# EAGLE design LLAP_Temp (EAGLE 7.1.0)
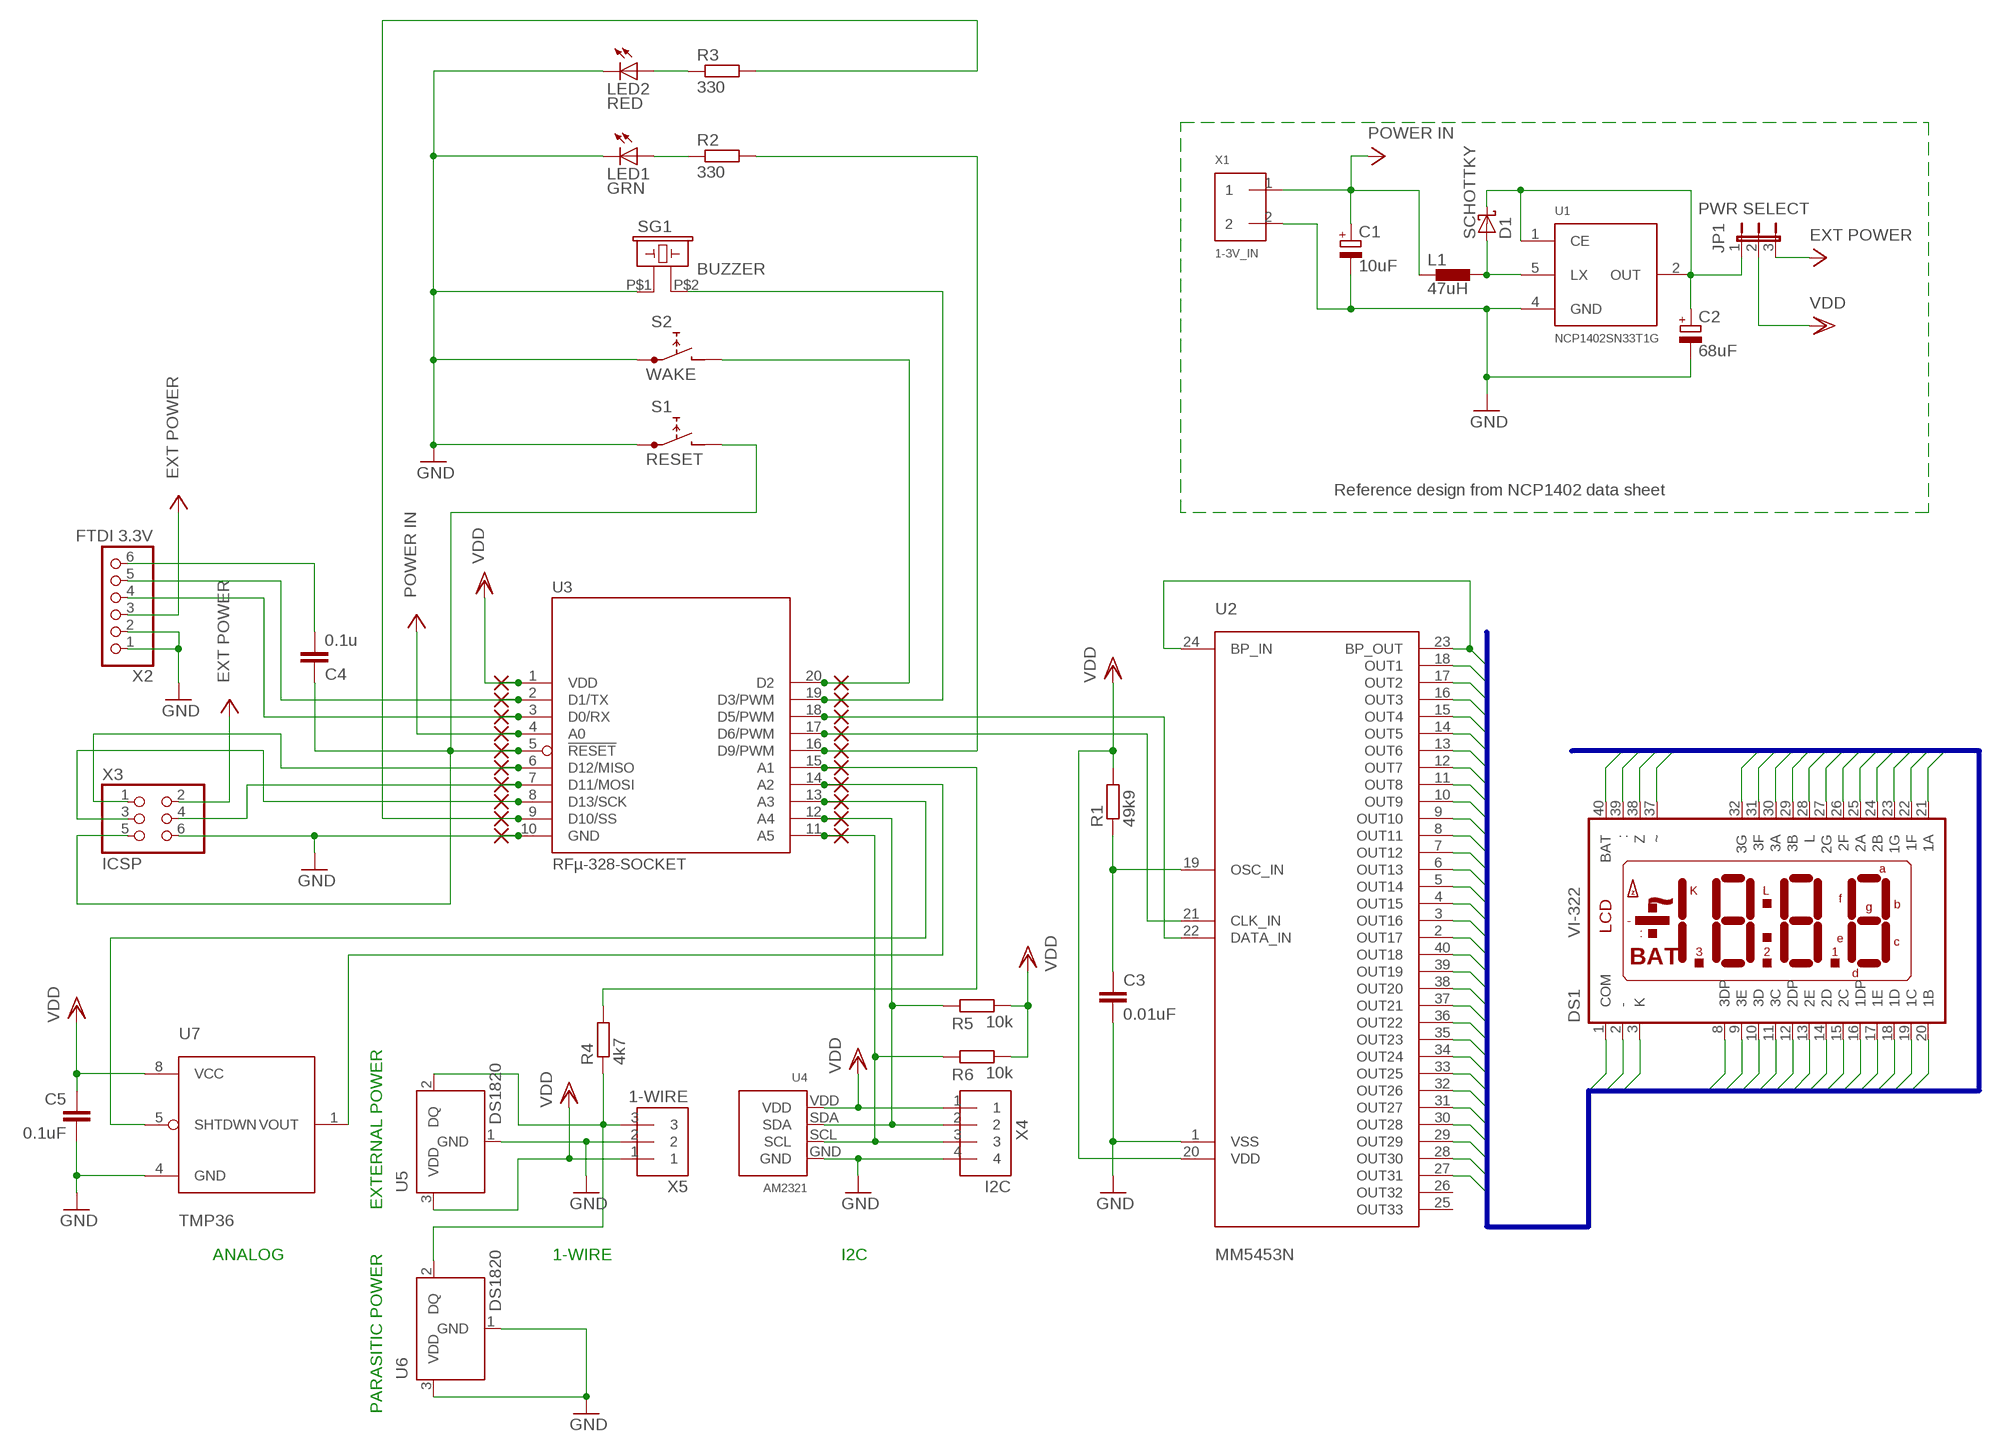
[diagram p0: schematic, sheet 1]

## Parts
C1  10uF  T491EIA6032-25  [EIA6032–25]
C2  68uF  T491EIA7343-31  [EIA7343-31]
C3  0.01uF  C-EUC0805  [C0805]
C4  0.1u  C-EUC0805  [C0805]
C5  0.1uF  C-EUC0805  [C0805]
D1  SCHOTTKY  DIODE_SCHOTTKY  [SOT-123_DIODE]
DS1  VI-322  LCD-VARITRONIX-VI-322  [LCD-VARITRONIX-VI-322]
JP1  PWR SELECT  JP2E  [JP2]
L1  47uH  SRN5040SRN5040SRN5040  [SRN5040]
LED1  GRN  LED3MM  [LED3MM]
LED2  RED  LED3MM  [LED3MM]
PAD1  VDD  1,6/0,9  [PAD_1,6/0,9]
PAD2  TX  1,6/0,9  [PAD_1,6/0,9]
PAD3  RX  1,6/0,9  [PAD_1,6/0,9]
PAD4  BATT V.  1,6/0,9  [PAD_1,6/0,9]
PAD5  RST  1,6/0,9  [PAD_1,6/0,9]
PAD6  MISO  1,6/0,9  [PAD_1,6/0,9]
PAD7  MOSI  1,6/0,9  [PAD_1,6/0,9]
PAD8  SCK  1,6/0,9  [PAD_1,6/0,9]
PAD9  LED2  1,6/0,9  [PAD_1,6/0,9]
PAD10  GND  1,6/0,9  [PAD_1,6/0,9]
PAD11  SCL  1,6/0,9  [PAD_1,6/0,9]
PAD12  SDA  1,6/0,9  [PAD_1,6/0,9]
PAD13  TMP SHTDWN  1,6/0,9  [PAD_1,6/0,9]
PAD14  TMP MEAS.  1,6/0,9  [PAD_1,6/0,9]
PAD15  1-WIRE  1,6/0,9  [PAD_1,6/0,9]
PAD16  LED1  1,6/0,9  [PAD_1,6/0,9]
PAD17  LCD CLK  1,6/0,9  [PAD_1,6/0,9]
PAD18  LCD DATA  1,6/0,9  [PAD_1,6/0,9]
PAD19  BUZZER  1,6/0,9  [PAD_1,6/0,9]
PAD20  WAKE BTN  1,6/0,9  [PAD_1,6/0,9]
R1  49k9  R-EU_R0805  [R0805]
R2  330  R-EU_R0805  [R0805]
R3  330  R-EU_R0805  [R0805]
R4  4k7  R-EU_R0805  [R0805]
R5  10k  R-EU_R0805  [R0805]
R6  10k  R-EU_R0805  [R0805]
S1  RESET  SWITCH-MJTP1243/MJTP1250MJTP1243/MJTP1250  [SWITCH-MJTP12XX]
S2  WAKE  SWITCH-MJTP1243/MJTP1250MJTP1243/MJTP1250  [SWITCH-MJTP12XX]
SG1  BUZZER  BUZZER-PUI_AUDIO-AT-1340-TT-R  [BUZZER-PUI_AUDIO-AT-1340-TT-R]
U1  NCP1402SN33T1G  NCP1402  [SOT23-5L]
U2  MM5453N  MM5453  [DIL40]
U3  RFµ-328-SOCKET  [RFµ-328-SOCKET]
U4  AM2321  AOSONG-AM2321AM2321  [AM2321]
U5  DS1820  [TO-92]
U6  DS1820  [TO-92]
U7  TMP36  TMP35/TMP36/TMP37SOIC8  [SOIC8]
X1  1-3V_IN  CON-AMP-440055-2440055-2  [CON-AMP-440055-2]
X2  FTDI 3.3V  PINHD-1X6  [1X06]
X3  ICSP  PINHD-2X3  [2X03]
X4  I2C  CON-AMP-440055-4440055-4  [CON-AMP-440055-4]
X5  1-WIRE  CON-AMP-440055-3440055-3  [CON-AMP-440055-3]

## Nets
3.3V: C2.P$2(+) D1.C JP1.1 U1.1(CE) U1.2(OUT)
BP: DS1.1(COM) U2.23(BP_OUT) U2.24(BP_IN)
EXT_PWR: JP1.3 X2.3 X3.2 ; supply symbol labelled EXT POWER
GND: C1.P$1(-) C2.P$1(-) C3.2 C5.2 LED1.K(C) LED2.K(C) PAD10.1(P) S1.P$1 S2.P$1 SG1.P$1 U1.4(GND) U2.1(VSS) U3.10(GND) U4.GND U5.1(GND) U6.1(GND) U6.3(VDD) U7.4(GND) X1.2 X2.1 X2.2 X3.6 X4.4 X5.2
LCD1: DS1.21(1A) U2.18(OUT1)
LCD2: DS1.20(1B) U2.17(OUT2)
LCD3: DS1.19(1C) U2.16(OUT3)
LCD4: DS1.18(1D) U2.15(OUT4)
LCD5: DS1.17(1E) U2.14(OUT5)
LCD6: DS1.22(1F) U2.13(OUT6)
LCD7: DS1.23(1G) U2.12(OUT7)
LCD8: DS1.16(1DP) U2.11(OUT8)
LCD9: DS1.25(2A) U2.10(OUT9)
LCD10: DS1.24(2B) U2.9(OUT10)
LCD11: DS1.15(2C) U2.8(OUT11)
LCD12: DS1.14(2D) U2.7(OUT12)
LCD13: DS1.13(2E) U2.6(OUT13)
LCD14: DS1.26(2F) U2.5(OUT14)
LCD15: DS1.27(2G) U2.4(OUT15)
LCD16: DS1.12(2DP) U2.3(OUT16)
LCD17: DS1.28(L) U2.2(OUT17)
LCD18: DS1.30(3A) U2.40(OUT18)
LCD19: DS1.29(3B) U2.39(OUT19)
LCD20: DS1.11(3C) U2.38(OUT20)
LCD21: DS1.10(3D) U2.37(OUT21)
LCD22: DS1.9(3E) U2.36(OUT22)
LCD23: DS1.31(3F) U2.35(OUT23)
LCD24: DS1.32(3G) U2.34(OUT24)
LCD25: DS1.8(3DP) U2.33(OUT25)
LCD26: DS1.3(K) U2.32(OUT26)
LCD27: DS1.2(-) U2.31(OUT27)
LCD28: DS1.39(:) U2.30(OUT28)
LCD29: DS1.40(BAT) U2.29(OUT29)
LCD30: DS1.38(Z) U2.28(OUT30)
LCD31: DS1.37(~) U2.27(OUT31)
N$1: C4.1 PAD5.1(P) S1.P$2 U3.5(!RESET) X3.5
N$2: PAD15.1(P) R4.2 U3.15(A1)
N$3: PAD6.1(P) U3.6(D12/MISO) X3.1
N$4: R4.1 U5.2(DQ) U6.2(DQ) X5.3
N$5: PAD13.1(P) U3.13(A3) U7.5(SHTDWN)
N$6: LED2.A R3.1
N$7: PAD14.1(P) U3.14(A2) U7.1(VOUT)
N$9: PAD2.1(P) U3.2(D1/TX) X2.5
N$10: PAD3.1(P) U3.3(D0/RX) X2.4
N$18: PAD18.1(P) U2.22(DATA_IN) U3.18(D5/PWM)
N$19: PAD17.1(P) U2.21(CLK_IN) U3.17(D6/PWM)
N$37: D1.A L1.2 U1.5(LX)
N$38: C3.1 R1.1 U2.19(OSC_IN)
N$39: LED1.A R2.1
N$40: PAD16.1(P) R2.2 U3.16(D9/PWM)
N$41: C4.2 X2.6
N$42: PAD8.1(P) U3.8(D13/SCK) X3.3
N$48: PAD7.1(P) U3.7(D11/MOSI) X3.4
N$50: PAD9.1(P) R3.2 U3.9(D10/SS)
N$52: PAD20.1(P) S2.P$2 U3.20(D2)
N$53: PAD11.1(P) R6.1 U3.11(A5) U4.SCL X4.3
N$54: PAD12.1(P) R5.1 U3.12(A4) U4.SDA X4.2
N$55: PAD19.1(P) SG1.P$2 U3.19(D3/PWM)
POWER_IN: C1.P$2(+) L1.1 PAD4.1(P) U3.4(A0) X1.1 ; supply symbol labelled POWER IN
VDD: C5.1 JP1.2 PAD1.1(P) R1.2 R5.2 R6.2 U2.20(VDD) U3.1(VDD) U4.VDD U5.3(VDD) U7.8(VCC) X4.1 X5.1
Unconnected: U2.25(OUT33) U2.26(OUT32)

## Buses
LCD[1..33],BP

## Notes on the sheet
- Reference design from NCP1402 data sheet
- EXTERNAL POWER
- ANALOG | 1-WIRE | I2C
- PARASITIC POWER

## Library data of the parts
C1 C2 = Johan:T491: T491 Series Industrial Grade MnO2 Tantalum Surface Mount Capacitor
C3-C5 = rcl:C-EU: CAPACITOR, European symbol
D1 = Johan:DIODE_SCHOTTKY: Schottky Power Rectifier Source: http://www.onsemi.com/pub/Collateral/MBRS130LT3-D.PDF
DS1 = Johan:LCD-VARITRONIX-VI-322: Varitronix LCD display, 3,5 digits 7 segment VI-322
JP1 = Johan:JP2E: JUMPER
L1 = Johan:SRN5040: BOURNS (R) SRN5040 Series - Semi-shielded Power Inductors
LED1 LED2 = led:LED: LED OSRAM: - CHIPLED LG R971, LG N971, LY N971, LG Q971, LY Q971, LO R971, LY R971 LH N974, LH R974 LS Q976, LO Q976, LY Q976 LO Q996 - Hyper CHIPLED LW Q18S LB Q993, LB Q99A, LB R99A - SideLED LS A670, LO A670, LY A670, LG A670, LP A670 LB A673, LV A673, LT A673, LW A673 LH A674 LY A675 LS A676, LA A676, LO A676, LY A676, LW A676 LS A679, LY A679, LG A679 - Hyper Micro SIDELED® LS Y876, LA Y876, LO Y876, LY Y876 LT Y87S - SmartLED LW L88C, LW L88S LB L89C, LB L89S, LG L890 LS L89K, LO L89K, LY L89K LS L896, LA L896, LO L896, LY L896 - TOPLED LS T670, LO T670, LY T670, LG T670, LP T670 LSG T670, LSP T670, LSY T670, LOP T670, LYG T670 LG T671, LOG T671, LSG T671 LB T673, LV T673, LT T673, LW T673 LH T674 LS T676, LA T676, LO T676, LY T676, LB T676, LH T676, LSB T676, LW T676 LB T67C, LV T67C, LT T67C, LS T67K, LO T67K, LY T67K, LW E67C LS E67B, LA E67B, LO E67B, LY E67B, LB E67C, LV E67C, LT E67C LW T67C LS T679, LY T679, LG T679 LS T770, LO T770, LY T770, LG T770, LP T770 LB T773, LV T773, LT T773, LW T773 LH T774 LS E675, LA E675, LY E675, LS T675 LS T776, LA T776, LO T776, LY T776, LB T776 LHGB T686 LT T68C, LB T68C - Hyper Mini TOPLED® LB M676 - Mini TOPLED Santana® LG M470 LS M47K, LO M47K, LY M47K Source: http://www.osram.convergy.de LUXEON: - LUMILED® LXK2-PW12-R00, LXK2-PW12-S00, LXK2-PW14-U00, LXK2-PW14-V00 LXK2-PM12-R00, LXK2-PM12-S00, LXK2-PM14-U00 LXK2-PE12-Q00, LXK2-PE12-R00, LXK2-PE12-S00, LXK2-PE14-T00, LXK2-PE14-U00 LXK2-PB12-K00, LXK2-PB12-L00, LXK2-PB12-M00, LXK2-PB14-N00, LXK2-PB14-P00, LXK2-PB14-Q00 LXK2-PR12-L00, LXK2-PR12-M00, LXK2-PR14-Q00, LXK2-PR14-R00 LXK2-PD12-Q00, LXK2-PD12-R00, LXK2-PD12-S00 LXK2-PH12-R00, LXK2-PH12-S00 LXK2-PL12-P00, LXK2-PL12-Q00, LXK2-PL12-R00 Source: www.luxeon.com KINGBRIGHT: KA-3528ASYC Source: www.kingbright.com
PAD1-PAD20 = Johan:1,6/0,9: THROUGH-HOLE PAD
R1-R6 = rcl:R-EU_: RESISTOR, European symbol
S1 S2 = Johan:SWITCH-MJTP1243/MJTP1250: APEN - MJTP series 6mm through hole tactile switches
SG1 = Johan:BUZZER-PUI_AUDIO-AT-1340-TT-R: Piezo electric transducer PUI Audio - AT-1340-TT-R
U1 = Johan:NCP1402: On Semiconductor® - NCP1402 Step-Up Micropower Switching Regulator The NCP1402 series are monolithic micropower step−up DC to DC converter that are specially designed for powering portable equipment from one or two cell battery packs
U2 = Johan:MM5453: Texas Instruments - MM5453 Liquid Crystal Display Driver
U3 = Ciseco Footprints:RFµ-328
U4 = Johan:AOSONG-AM2321: Aosong Electronics Co. - AM2321 Digital-output relative humidity & temperature sensor/module, I2C
U5 U6 = DS1820:DS1820: DS1820 - 1-Wire Digital Thermometer
U7 = Johan:TMP35/TMP36/TMP37
X1 = Johan:CON-AMP-440055-2: AMP 440055-2 2-pin connector, 2mm pitch
X2 = Johan:PINHD-1X6: PIN HEADER
X3 = pinhead:PINHD-2X3: PIN HEADER
X4 = Johan:CON-AMP-440055-4: AMP 440055-4 4-pin connector, 2mm pitch
X5 = Johan:CON-AMP-440055-3: AMP 440055-3 3-pin connector, 2.0 mm pitch

## Board
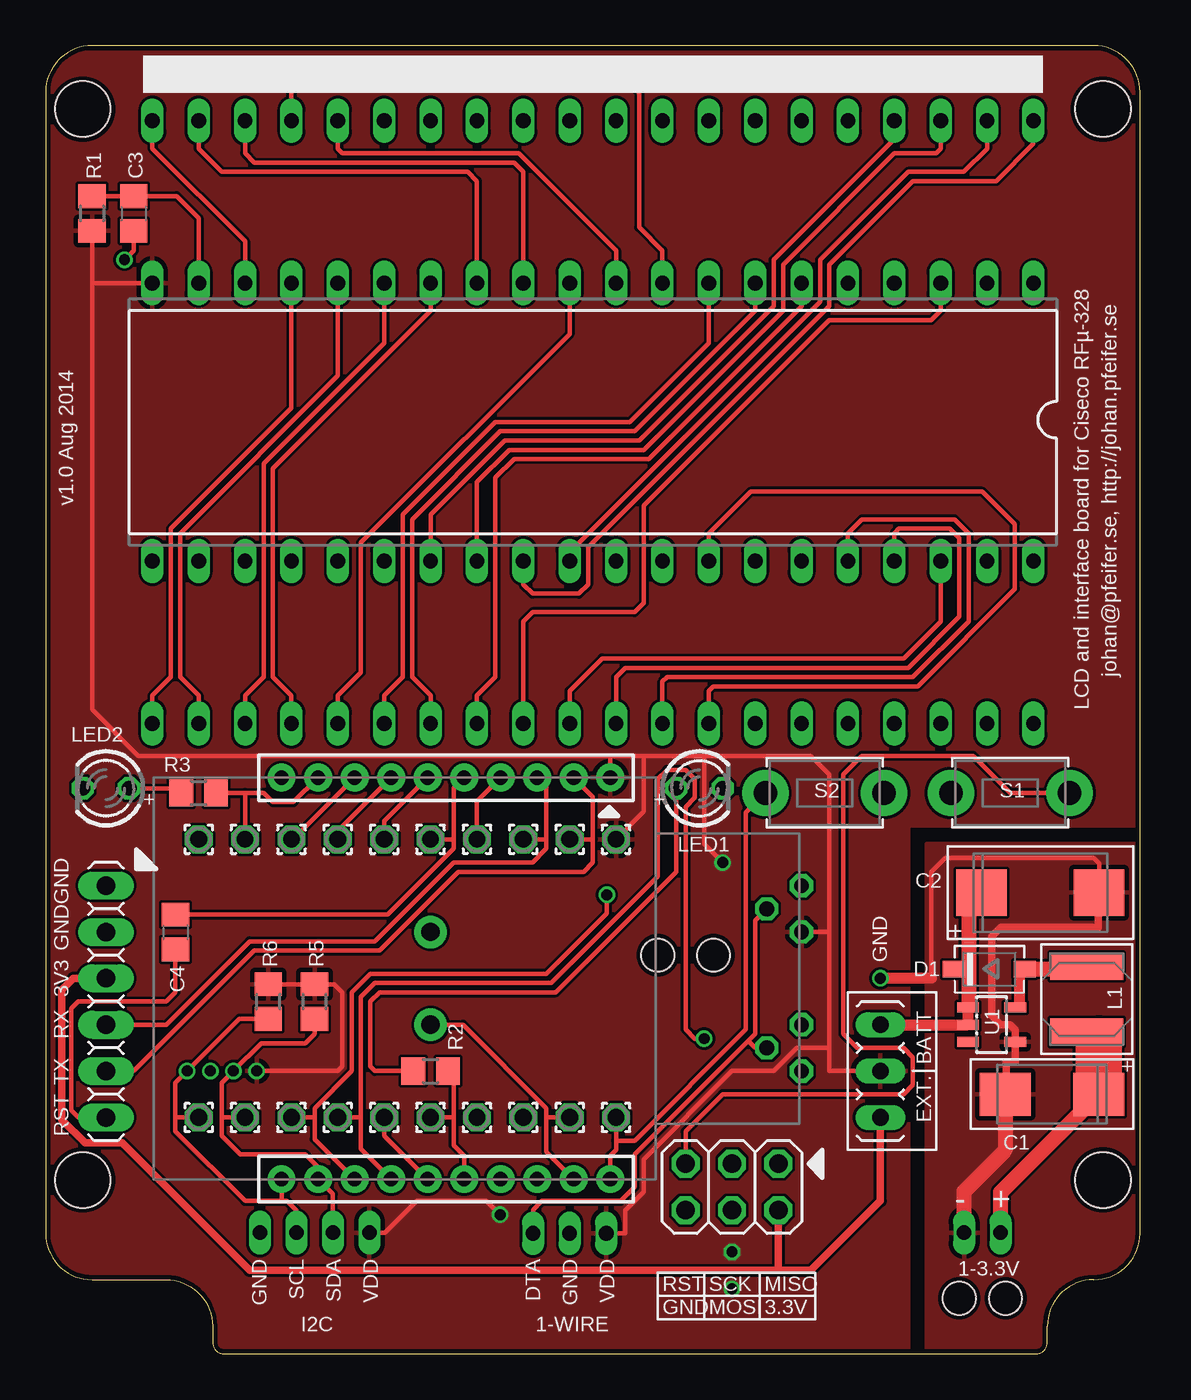
[diagram p1: board, top side]
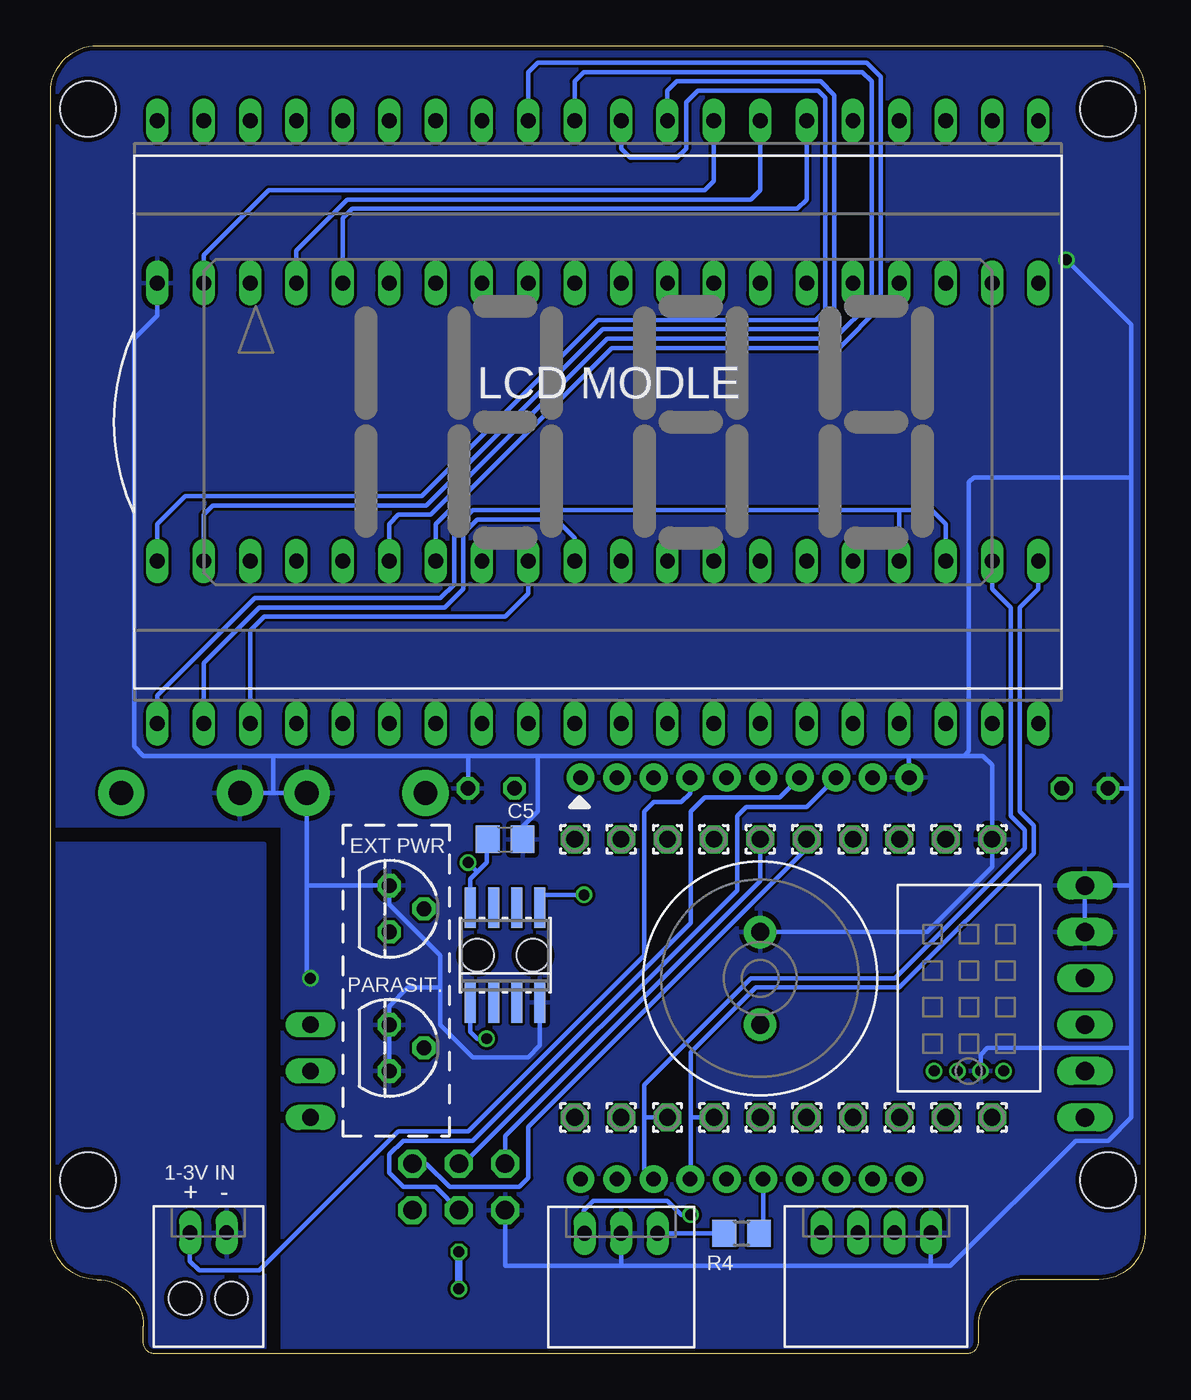
[diagram p2: board, bottom side, seen from below]

Size 59.94 x 71.68 mm. Coordinates in mm from the lower left corner, seen from the top.
Outline: 0,69.14 0,6.6 arc90 2.54,4.06 6.6,4.06 arc-90 9.14,1.52 9.14,0.64 arc90 9.78,0 54.23,0 arc90 54.86,0.64 54.86,1.52 arc-90 57.4,4.06 arc90 59.94,6.6 59.94,69.14 arc90 57.4,71.68 2.54,71.68 arc90 0,69.14
Copper layers (1*16): Top 0.035mm / dielectric 0.2mm / Bottom 0.035mm
Design rules "SeeedStudio_DRU_no_angle_20130527 *": minimum track width 6mil, minimum drill 12mil, track to track 6mil, track to pad 6mil, pad to pad 6mil, via to via 6mil, smd to smd 0mil, copper to edge 10mil, drill to drill 10mil, minimum pad ring 6mil, minimum via ring 6mil, stop-mask expansion 2mil, vias tented up to drill 25mil, thermal gap 10mil
Holes 3.05 mm at 2.03,68.2 2.03,9.53 57.91,9.53 57.91,68.2
Holes 1.8 mm at 33.53,21.84 36.58,21.84 52.58,3.05 50.04,3.05
bKeepout: area 55.4,7 to 60.5,12.1; area 55.4,65.7 to 60.5,70.7; area -0.5,65.7 to 4.6,70.7; area -0.5,7 to 4.6,12.1

### Footprints (pad centres in the part's own frame; a part is rotated, then mirrored left to right if it is on the bottom)
EIA6032–25 = smd 2.77 x 2.35: P$1 -2.56,0; P$2 2.56,0
EIA7343-31 = smd 2.77 x 2.55: P$1 -3.22,0; P$2 3.22,0
C0805 = smd 1.3 x 1.5: 1 -0.95,0; 2 0.95,0
SOT-123_DIODE = smd 1.22 x 0.91: A 1.94,0; C -1.94,0
LCD-VARITRONIX-VI-322 = drill 0.813 long: 1 -24.13,-16.51; 2 -21.59,-16.51; 3 -19.05,-16.51; 4 -16.51,-16.51; 5 -13.97,-16.51; 6 -11.43,-16.51; 7 -8.89,-16.51; 8 -6.35,-16.51; 9 -3.81,-16.51; 10 -1.27,-16.51; 11 1.27,-16.51; 12 3.81,-16.51; 13 6.35,-16.51; 14 8.89,-16.51; 15 11.43,-16.51; 16 13.97,-16.51; 17 16.51,-16.51; 18 19.05,-16.51; 19 21.59,-16.51; 20 24.13,-16.51; 21 24.13,16.51; 22 21.59,16.51; 23 19.05,16.51; 24 16.51,16.51; 25 13.97,16.51; 26 11.43,16.51; 27 8.89,16.51; 28 6.35,16.51; 29 3.81,16.51; 30 1.27,16.51; 31 -1.27,16.51; 32 -3.81,16.51; 33 -6.35,16.51; 34 -8.89,16.51; 35 -11.43,16.51; 36 -13.97,16.51; 37 -16.51,16.51; 38 -19.05,16.51; 39 -21.59,16.51; 40 -24.13,16.51
JP2 = drill 0.914 long: 1 -2.54,0; 2 0,0; 3 2.54,0
SRN5040 = smd 1.5 x 4: 1 -1.8,0; 2 1.8,0
LED3MM = drill 0.813 octagon: A -1.27,0; K 1.27,0
PAD_1,6/0,9 = drill 0.914 pad 1.524 octagon: 1 0,0
R0805 = smd 1.3 x 1.5: 1 -0.95,0; 2 0.95,0
SWITCH-MJTP12XX = drill 1.3 pad 2.54: P$1 -3.25,0; P$2 3.25,0
BUZZER-PUI_AUDIO-AT-1340-TT-R = drill 1 pad 1.778: P$1 -2.54,0; P$2 2.54,0
SOT23-5L = smd 0.55 x 1.2: 1 -0.95,-1.3; 2 0,-1.3; 3 0.95,-1.3; 4 0.95,1.3; 5 -0.95,1.3
DIL40 = drill 0.813 long: 1 -24.13,-7.62; 2 -21.59,-7.62; 3 -19.05,-7.62; 4 -16.51,-7.62; 5 -13.97,-7.62; 6 -11.43,-7.62; 7 -8.89,-7.62; 8 -6.35,-7.62; 9 -3.81,-7.62; 10 -1.27,-7.62; 11 1.27,-7.62; 12 3.81,-7.62; 13 6.35,-7.62; 14 8.89,-7.62; 15 11.43,-7.62; 16 13.97,-7.62; 17 16.51,-7.62; 18 19.05,-7.62; 19 21.59,-7.62; 20 24.13,-7.62; 21 24.13,7.62; 22 21.59,7.62; 23 19.05,7.62; 24 16.51,7.62; 25 13.97,7.62; 26 11.43,7.62; 27 8.89,7.62; 28 6.35,7.62; 29 3.81,7.62; 30 1.27,7.62; 31 -1.27,7.62; 32 -3.81,7.62; 33 -6.35,7.62; 34 -8.89,7.62; 35 -11.43,7.62; 36 -13.97,7.62; 37 -16.51,7.62; 38 -19.05,7.62; 39 -21.59,7.62; 40 -24.13,7.62
RFµ-328-SOCKET = drill 0.8 pad 1.524: 1 -11,20; 2 -11,18; 3 -11,16; 4 -11,14; 5 -11,12; 6 -11,10; 7 -11,8; 8 -11,6; 9 -11,4; 10 -11,2; 11 11,2; 12 11,4; 13 11,6; 14 11,8; 15 11,10; 16 11,12; 17 11,14; 18 11,16; 19 11,18; 20 11,20
AM2321 = drill 0.6: GND 0,-0.635; SCL 0,-1.905; SDA 0,0.635; VDD 0,1.905
TO-92 = drill 0.813 pad 1.27 octagon: 1 -1.27,0; 2 0,1.905; 3 1.27,0
SOIC8 = smd 0.6 x 2.2: 1 -1.905,-2.6; 2 -0.635,-2.6; 3 0.635,-2.6; 4 1.905,-2.6; 5 1.905,2.6; 6 0.635,2.6; 7 -0.635,2.6; 8 -1.905,2.6
CON-AMP-440055-2 = drill 0.8 long: 1 -0.04,-1; 2 -0.04,1
1X06 = drill 1.016 long: 1 -6.35,0; 2 -3.81,0; 3 -1.27,0; 4 1.27,0; 5 3.81,0; 6 6.35,0
2X03 = drill 1.016 octagon: 1 -2.54,-1.27; 2 -2.54,1.27; 3 0,-1.27; 4 0,1.27; 5 2.54,-1.27; 6 2.54,1.27
CON-AMP-440055-4 = drill 0.8 long: 1 -0.04,-3; 2 -0.04,-1; 3 -0.04,1; 4 -0.04,3
CON-AMP-440055-3 = drill 0.8 long: 1 0,-2; 2 0,0; 3 0,2

### Placement (x,y rotation side)
C1  55.12,14.22 0 top
C2  54.48,25.27 180 top
C3  4.83,62.48 270 top
C4  7.11,23.11 270 top
C5  35.05,28.19 0 bottom
D1  51.69,21.08 0 top
DS1  29.97,51.05 0 bottom
JP1  45.72,15.49 270 top
L1  57.02,19.43 90 top
LED1  35.81,30.99 0 top
LED2  3.3,30.99 180 top
PAD1  31.24,28.19 0 top
PAD2  28.7,28.19 0 top
PAD3  26.16,28.19 0 top
PAD4  23.62,28.19 0 top
PAD5  21.08,28.19 0 top
PAD6  18.54,28.19 0 top
PAD7  16,28.19 0 top
PAD8  13.46,28.19 0 top
PAD9  10.92,28.19 0 top
PAD10  8.38,28.19 0 top
PAD11  8.38,12.95 0 top
PAD12  10.92,12.95 0 top
PAD13  13.46,12.95 0 top
PAD14  16,12.95 0 top
PAD15  18.54,12.95 0 top
PAD16  21.08,12.95 0 top
PAD17  23.62,12.95 0 top
PAD18  26.16,12.95 0 top
PAD19  28.7,12.95 0 top
PAD20  31.24,12.95 0 top
R1  2.54,62.48 270 top
R2  21.08,15.49 0 top
R3  8.38,30.73 0 top
R4  22.1,6.6 0 bottom
R5  14.73,19.3 90 top
R6  12.19,19.3 90 top
S1  52.83,30.73 0 top
S2  42.67,30.73 180 top
SG1  21.08,20.57 270 bottom
U1  51.82,18.03 270 top
U2  29.97,51.05 180 top
U3  10.92,20.57 270 top
U4  9.65,15.49 90 bottom
U5  41.4,24.38 270 bottom
U6  41.4,16.76 270 bottom
U7  35.05,21.84 0 bottom
X1  51.31,6.6 270 bottom
X2  3.3,19.3 270 top
X3  37.59,9.14 180 top
X4  14.73,6.6 270 bottom
X5  28.7,6.6 270 bottom

### Tracks (layer width: path | path; a pad name or v marks a point on that pad's centre or on a via)
3.3V
  Top 0.61: JP1.1 U1.2 U1.1 50.55,18.98
  Top 0.813: C2.P$2 50.93,25.27 50.55,24.89 50.55,21.08 | 50.55,21.08 50.55,18.98 | D1.C 50.55,21.08
BP
  Bottom 0.254: U2.23 10.92,45.47 11.68,46.23 13.46,46.23 | 13.46,46.23 36.83,46.23 37.85,45.21 37.85,42.16 38.61,41.4 48.77,41.4 54.1,36.07 DS1.1 | U2.24 13.46,46.23
EXT_PWR
  Top 0.406: X2.3 1.52,20.57 0.89,19.94 0.89,12.83 2.16,11.56 4.19,11.56 11.18,4.57 40.13,4.57 | 40.13,4.57 41.91,4.57 45.72,8.38 JP1.3 | X3.2 40.13,4.57
GND  (via drill 0.6)
  Top 0.254: C2.P$1 57.7,26.88 57.4,27.18 49.28,27.18 48.51,26.42 48.51,20.57 | C3.2 4.83,60.45 v4.32,59.94
  Top 0.406: C2.P$1 57.66,25.23 57.66,23.37 52.32,23.37 51.82,22.86 51.82,18.54 52.32,18.03 52.83,18.03 53.12,17.75 U1.4 53.12,16 52.61,16 52.61,14.27
  Top 0.61: 48.51,20.57 v45.72,20.57
  Top 0.813: X1.2 50.31,8.91 52.56,11.16 C1.P$1 52.61,14.27
  Bottom 0.254: 0.76,16.76 0.76,12.95 2.03,11.68 3.81,11.68 10.67,4.83 11.68,4.83 | 0.76,16.76 0.76,25.65 | X5.2 28.7,4.83 | 28.7,4.83 11.68,4.83 | X3.6 35.05,4.83 28.7,4.83 | U4.GND 9.02,16.38 8.64,16.76 0.76,16.76 | 45.92,25.65 S2.P$1 47.75,30.73 | 45.92,25.65 45.92,20.37 v45.72,20.57 | 45.92,25.65 U5.1 41.4,24.64 38.61,21.84 38.61,20.07 | X4.4 11.73,4.87 11.68,4.83 | LED2.K 0.76,30.99 | 0.76,30.99 0.76,25.65 | v4.32,59.94 0.76,56.39 0.76,48.01 | U2.1 54.1,56.9 55.37,55.63 55.37,33.27 54.86,32.77 47.75,32.77 | 47.75,32.77 37.08,32.77 | 37.08,32.77 33.27,32.77 | 33.27,32.77 12.95,32.77 | 12.95,32.77 12.95,31.61 U3.10 | S1.P$1 47.75,30.73 | 47.75,30.73 47.75,32.77 | LED1.K 37.08,32.77 | 9.91,32.77 8.89,32.77 8.38,32.26 PAD10.1 8.38,26.67 11.94,23.11 SG1.P$1 | 9.91,32.77 12.95,32.77 | 0.76,25.65 X2.1 X2.2 | 0.76,30.99 0.76,48.01 | 0.76,48.01 9.4,48.01 9.65,47.75 9.65,33.02 9.91,32.77 | 38.61,20.07 38.61,18.03 36.83,16.26 33.78,16.26 33.15,16.89 U7.4 | U6.1 U6.3 41.4,19.05 40.39,20.07 38.61,20.07 | C5.2 34.1,28.89 33.27,29.72 33.27,32.77
  pour Top: 59.94,27.94 48.26,27.94 48.26,0 59.94,0
  pour Bottom: 59.94,71.37 59.94,28.96 47.24,28.96 47.24,0 0,0 0,71.37
  pour Bottom: 59.94,27.94 48.26,27.94 48.26,0 59.94,0
LCD1
  Top 0.254: DS1.21 5.84,66.04 10.92,60.96 U2.18
LCD2
  Top 0.254: U2.17 13.46,51.82 6.86,45.21 6.86,37.08 5.84,36.07 DS1.20
LCD3
  Top 0.254: U2.16 16,53.59 7.37,44.96 7.37,37.08 8.38,36.07 DS1.19
LCD4
  Top 0.254: U2.15 18.54,55.37 11.94,48.77 11.94,37.08 10.92,36.07 DS1.18
LCD5
  Top 0.254: U2.14 21.08,57.15 12.45,48.51 12.45,37.08 13.46,36.07 DS1.17
LCD6
  Top 0.254: DS1.22 8.38,66.04 9.65,64.77 23.11,64.77 23.62,64.26 U2.13
LCD7
  Top 0.254: DS1.23 10.92,65.79 11.43,65.28 25.65,65.28 26.16,64.77 U2.12
LCD8
  Top 0.254: U2.11 28.7,55.88 17.27,44.45 17.27,37.34 16,36.07 DS1.16
LCD9
  Top 0.254: DS1.25 16,66.04 16.26,65.79 25.91,65.79 31.24,60.45 U2.10
LCD10
  Top 0.254: DS1.24 13.46,69.09 13.97,69.6 32,69.6 32.51,69.09 32.51,61.72 33.78,60.45 U2.9
LCD11
  Top 0.254: U2.8 36.32,55.37 32,51.05 24.64,51.05 19.56,45.97 19.56,37.08 18.54,36.07 DS1.15
LCD12
  Top 0.254: U2.7 38.86,57.15 32.26,50.55 24.89,50.55 20.07,45.72 20.07,37.08 21.08,36.07 DS1.14
LCD13
  Top 0.254: U2.6 41.4,57.4 33.02,49.02 25.65,49.02 24.64,48.01 24.64,37.08 23.62,36.07 DS1.13
LCD14
  Bottom 0.254: U2.5 43.94,62.23 43.43,62.74 19.05,62.74 18.54,63.25 DS1.26
LCD15
  Bottom 0.254: U2.4 46.48,60.45 43.69,63.25 21.59,63.25 21.08,63.75 DS1.27
LCD16
  Top 0.254: U2.3 49.02,57.15 48.51,56.64 42.93,56.64 32.77,46.48 32.77,41.15 32.26,40.64 26.67,40.64 26.16,40.13 DS1.12
LCD17
  Bottom 0.254: U2.2 51.56,60.2 48.01,63.75 24.13,63.75 23.62,64.26 DS1.28
LCD18
  Bottom 0.254: U2.40 54.1,45.47 52.58,46.99 39.62,46.99 29.97,56.64 18.03,56.64 17.53,57.15 17.53,68.83 17.91,69.22 24.51,69.22 25.15,68.58 25.15,66.04 25.65,65.53 28.19,65.53 28.7,66.04 DS1.30
LCD19
  Bottom 0.254: U2.39 51.56,45.97 51.05,46.48 39.37,46.48 29.72,56.13 17.78,56.13 17.02,56.9 17.02,68.96 17.78,69.72 25.65,69.72 26.16,69.22 DS1.29
LCD20
  Top 0.254: DS1.11 28.7,36.32 30.48,38.1 46.99,38.1 49.02,40.13 U2.38
LCD21
  Top 0.254: DS1.10 31.24,37.08 31.75,37.59 47.24,37.59 50.04,40.39 50.04,44.7 49.53,45.21 46.74,45.21 46.48,44.96 U2.37
LCD22
  Top 0.254: DS1.9 33.78,36.83 34.04,37.08 47.5,37.08 50.55,40.13 50.55,44.96 49.78,45.72 44.7,45.72 43.94,44.96 U2.36
LCD23
  Bottom 0.254: U2.35 41.4,45.47 40.89,45.97 39.12,45.97 29.46,55.63 17.02,55.63 14.99,57.66 14.99,69.72 15.49,70.23 30.73,70.23 31.24,69.72 DS1.31
LCD24
  Bottom 0.254: U2.34 38.86,45.47 29.21,55.12 16.76,55.12 14.48,57.4 14.48,69.98 15.24,70.74 33.27,70.74 33.78,70.23 DS1.32
LCD25
  Top 0.254: DS1.8 36.32,36.32 36.58,36.58 47.75,36.58 53.09,41.91 53.09,45.47 51.31,47.24 38.61,47.24 36.32,44.96 U2.33
LCD26
  Bottom 0.254: U2.32 33.78,41.66 35.05,40.39 48.26,40.39 49.02,39.62 DS1.3
LCD27
  Bottom 0.254: U2.31 31.24,44.7 32.26,45.72 36.58,45.72 37.34,44.96 37.34,41.91 38.35,40.89 48.51,40.89 51.56,37.85 DS1.2
LCD28
  Top 0.254: DS1.39 51.56,66.04 50.29,64.77 47.24,64.77 42.42,59.94 42.42,57.66 28.7,43.94 U2.30
LCD29
  Top 0.254: DS1.40 54.1,66.29 52.07,64.26 47.5,64.26 42.93,59.69 42.93,57.4 29.72,44.2 29.72,42.16 29.21,41.66 26.67,41.66 26.16,42.16 U2.29
LCD30
  Top 0.254: DS1.38 49.02,66.04 48.77,65.79 46.48,65.79 40.39,59.69 40.39,57.15 32.77,49.53 25.4,49.53 23.62,47.75 U2.28
LCD31
  Top 0.254: DS1.37 46.48,66.55 39.88,59.94 39.88,57.4 32.51,50.04 25.15,50.04 21.08,45.97 U2.27
N$1
  Top 0.254: 22.35,28.19 22.35,31 U3.5 | 22.35,28.19 22.35,27.69 18.73,24.06 C4.1 | 22.35,28.19 PAD5.1 | S1.P$2 52.83,30.73 50.8,32.77 44.7,32.77 43.69,31.75 43.69,17.53 44.45,16.76 46.99,16.76 47.5,16.26 47.5,14.73 46.99,14.22 37.08,14.22 35.05,12.19 X3.5
  Bottom 0.254: X3.5 35.05,11.94 21.08,25.91 PAD5.1
N$2
  Top 0.254: PAD15.1 18.54,11.95 U3.15
  Bottom 0.254: U3.15 20.92,6.83 R4.2
N$3
  Top 0.254: PAD6.1 18.54,29.19 U3.6
  Bottom 0.254: X3.1 39.37,10.41 38.1,9.14 34.29,9.14 33.78,9.65 33.78,12.45 18.54,27.69 PAD6.1
N$4
  Top 0.254: X5.3 26.7,7.91 27.18,8.38 31.5,8.38 32.26,9.14 32.26,10.92 38.48,17.14 | 38.48,17.14 38.86,17.53 38.86,23.75 U5.2 | U6.2 38.86,16.76 38.48,17.14
  Bottom 0.254: R4.1 X5.3
N$5  (via drill 0.6)
  Top 0.254: v30.73,25.15 30.73,24.13 27.43,20.83 17.78,20.83 16.76,19.81 16.76,15.49 14.73,13.46 14.73,12.95 | 14.73,12.95 14.73,11.76 U3.13 | PAD13.1 14.73,12.95
  Bottom 0.254: v30.73,25.15 33.27,25.15 33.15,25.02 U7.5
N$6
  Top 0.254: LED2.A 7.18,30.99 R3.1
N$7  (via drill 0.6)
  Top 0.254: v36.07,17.27 35.56,17.27 35.05,17.78 35.05,29.97 35.56,30.48 35.56,31.5 35.05,32 34.04,32 33.53,31.5 33.53,26.16 27.69,20.32 18.03,20.32 17.27,19.56 17.27,12.95 | 17.27,12.95 17.27,11.22 U3.14 | PAD14.1 17.27,12.95
  Bottom 0.254: 37.02,20.07 36.96,20.01 U7.1 36.96,17.65 36.58,17.27 v36.07,17.27
N$9
  Top 0.254: X2.5 4.83,15.49 11.43,22.1 18.29,22.1 22.61,26.42 29.46,26.42 29.97,26.92 29.97,28.19 | 29.97,28.19 29.97,30.52 U3.2 | PAD2.1 29.97,28.19
N$10
  Top 0.254: X2.4 6.6,18.03 11.18,22.61 18.03,22.61 22.35,26.92 26.67,26.92 27.43,27.69 27.43,28.19 | 27.43,28.19 27.43,31.06 U3.3 | PAD3.1 27.43,28.19
N$18
  Bottom 0.254: U2.22 8.38,41.91 7.37,40.89 7.37,29.46 6.6,28.7 6.6,27.69 13.72,20.57 21.59,20.57 27.43,14.73 27.43,12.95 | 27.43,12.95 27.43,10.08 U3.18 | PAD18.1 27.43,12.95
N$19
  Bottom 0.254: U2.21 5.84,41.91 6.86,40.89 6.86,29.72 6.1,28.96 6.1,27.43 13.46,20.07 21.34,20.07 24.89,16.51 24.89,12.95 | 24.89,12.95 24.89,9.6 U3.17 | PAD17.1 24.89,12.95
N$37
  Top 0.254: U1.5 53.12,19.05 53.34,19.05 | 53.34,21.08 D1.A
  Top 0.61: 53.34,19.05 53.34,21.08 | L1.2 57.02,21.08 57.15,21.08
  Top 0.813: D1.A 57.15,21.08 57.28,21.08
N$38
  Top 0.254: C3.1 R1.1 7.18,63.43 8.38,62.23 U2.19
N$39
  Top 0.254: R2.1 18.03,15.49 17.78,15.75 17.78,19.3 18.29,19.81 27.94,19.81 34.54,26.42 LED1.A
N$40
  Top 0.254: U3.16 22.92,10.86 22.35,11.43 22.35,12.95 | 22.35,12.95 22.35,15.17 R2.2 | PAD16.1 22.35,12.95
N$41
  Top 0.254: X2.6 1.78,12.95 1.4,13.33 1.4,18.92 1.78,19.3 6.6,19.3 7.11,19.81 C4.2
N$42
  Top 0.254: PAD8.1 13.54,28.19 U3.8
  Bottom 0.254: X3.3 37.34,10.41 22.35,25.4 22.35,29.46 21.84,29.97 18.52,29.97 U3.8
N$48
  Top 0.254: PAD7.1 16,28.65 U3.7
  Bottom 0.254: X3.4 38.86,9.14 40.64,9.14 41.4,9.91 41.4,10.92 40.64,11.68 36.83,11.68 24.89,23.62 24.89,29.72 24.13,30.48 20.02,30.48 U3.7
N$50
  Top 0.254: R3.2 10.92,30.73 | 10.92,30.73 11.94,30.73 12.45,30.23 13.57,30.23 U3.9 | PAD9.1 10.92,30.73
N$52
  Top 0.254: S2.P$2 38.35,29.67 38.35,17.78 32.26,11.68 31.24,11.68 | PAD20.1 31.24,11.68 | 31.24,11.68 31.24,11.18 30.92,10.86 U3.20
N$53
  Top 0.254: 7.11,12.95 7.11,12.19 10.92,8.38 12.92,8.38 | 7.11,12.95 7.11,14.86 U4.SCL 10.61,18.35 R6.1 | PAD11.1 7.11,12.95 | 12.92,8.38 13.21,8.38 13.72,7.87 13.72,6.66 X4.3 | U3.11 12.92,8.38
N$54
  Top 0.254: X4.2 15.73,8.76 U3.12 14.92,10.22 14.22,10.92 10.67,10.92 9.65,11.94 9.65,12.95 | 9.65,12.95 9.65,14.86 U4.SDA 11.81,17.02 14.22,17.02 14.73,17.53 R5.1 | PAD12.1 9.65,12.95
N$55
  Top 0.254: SG1.P$2 22.86,18.03 27.43,13.46 27.43,12.95 | 27.43,12.95 27.43,11.06 U3.19 | PAD19.1 27.43,12.95
POWER_IN
  Top 0.254: PAD4.1 23.62,30.27 U3.4
  Top 0.406: 57.17,14.22 C1.P$2
  Top 0.61: L1.1 57.02,17.02 57.68,17.02
  Top 0.813: X1.1 52.31,8.85 C1.P$2
  Top 1.27: 57.68,14.5 arc-90 58.17,14.22 57.17,14.22
  Top 2.54: 57.68,14.5 57.68,17.02 57.68,17.12
  Bottom 0.254: U3.4 24.92,30.7 25.4,30.23 26.92,30.23 27.43,29.72 27.43,21.84 37.08,12.19 40.89,12.19 48.51,4.57 51.82,4.57 52.32,5.08 52.32,6.63 X1.1
VDD  (via drill 0.6)
  Top 0.254: X4.1 18.58,6.64 20.32,8.38 24.13,8.38 v24.89,7.62 | JP1.2 42.93,15.49 42.93,16.76 | 42.93,16.76 42.93,23.11 | 42.93,23.11 U5.3 | 42.93,16.76 41.15,16.76 39.88,15.49 37.59,15.49 32.77,10.67 32.77,8.89 31.75,7.87 31.75,6.6 X5.1 | 30.99,32.77 5.08,32.77 2.54,35.31 2.54,58.67 | 2.54,58.67 R1.2 | U2.20 2.54,58.67 | 36.07,32.77 41.91,32.77 42.93,31.75 42.93,23.11 | 36.07,32.77 32.77,32.77 | 32.77,32.77 30.99,32.77 | U3.1 30.92,32.7 30.99,32.77 | R6.2 R5.2 15.81,20.25 16.26,19.81 16.26,15.75 16,15.49 U4.VDD | v37.08,26.92 36.07,27.94 36.07,32.77 | PAD1.1 32.77,29.72 32.77,32.77
  Bottom 0.254: v24.89,7.62 25.4,7.62 26.16,8.38 30.23,8.38 30.73,7.87 30.73,6.64 X5.1 | C5.1 36.07,28.19 36.07,26.92 36.58,26.42 | 36.58,26.42 36.96,26.04 U7.8 36.83,24.57 | v37.08,26.92 36.58,26.42
  Bottom 0.406: v37.59,5.59 v37.59,3.56
  pour Top: 59.94,28.96 47.24,28.96 47.24,0 0,0 0,71.37 59.94,71.37

### Text on the board
tPlace: v1.0 Aug 2014 | johan@pfeifer.se, http://johan.pfeifer.se | LCD and interface board for Ciseco RFµ-328 | + | + | GND | GND | GND | 3V3 | RX | BATT | TX | RST | EXT. | - | + | GND | SCL | SDA | VDD | DTA | GND | VDD | 1-3.3V | RST | SCK | MISO | I2C | 1-WIRE | GND | MOSI | 3.3V
bPlace: LCD MODLE | EXT PWR | PARASIT. | 1-3V IN | - | +